# Altium schematic sheet [02] - BLOCK DIAGRAM.SchDoc
size A3; ApprovedBy: -; CheckedBy: -; DrawnBy: -
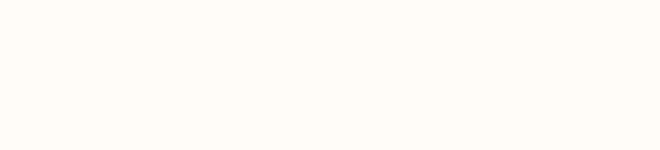
[diagram p0: [02] - BLOCK DIAGRAM.SchDoc]

## Notes on the sheet
- CLOCKS (CPU & PCIE)
- Project Title:
- Number:
- Date:
- Sheet Title:
- Drawn By:
- Sheet:
- Variant:
- of
- Checked By:
- Rev:
- Size:
- keepin
- Contact: